# Altium schematic sheet modulation_tx.SchDoc
size A4; SheetNumber: 1; SheetTotal: 1
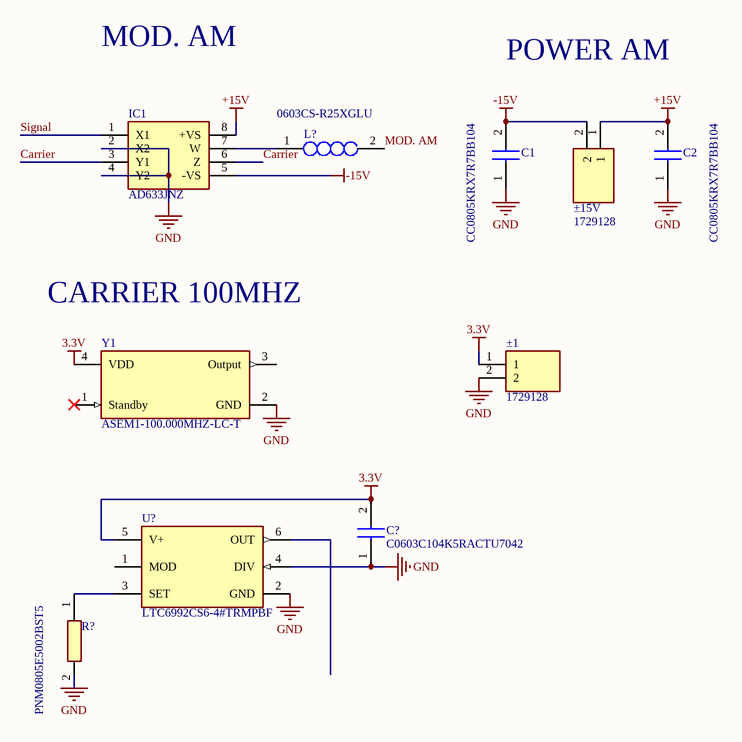
[diagram p0: modulation_tx.SchDoc]

## Parts
C1  CC0805KRX7R7BB104  [CAPC2012X95N]
C2  CC0805KRX7R7BB104  [CAPC2012X95N]
C?  C0603C104K5RACTU7042  [CAPC1608X95N]
IC1  AD633JNZ  [DIP794W56P254L959H533Q8N]
L?  0603CS-R25XGLU  [0603CS82NXGLW]
R?  PNM0805E5002BST5  [RESC2013X65N]
U?  LTC6992CS6-4#TRMPBF  [FP-S6-6-05-08-1636-IPC_A]
Y1  ASEM1-100.000MHZ-LC-T  [FP-ASEM-MFG]
±1  1729128  [1729128]
±15V  1729128  [1729128]

## Nets
3.3V: C?.2 U?.5(V+) Y1.4(VDD) ±1.1
+15V: C2.2 IC1.8(+VS) ±15V.1
-15V: C1.2 IC1.5(-VS) ±15V.2
GND: C1.1 C2.1 C?.1 IC1.2(X2) IC1.4(Y2) R?.2 U?.2(GND) U?.4(DIV) Y1.2(GND) ±1.2
Carrier: IC1.3(Y1) IC1.6(Z)
MOD. AM: L?.2
Signal: IC1.1(X1)
NetIC1_7: IC1.7(W) L?.1
NetR?_1: R?.1 U?.3(SET)

Not connected (* = marked no-connect by the designer): U? 1(MOD) 6(OUT); Y1 1(Standby)* 3(Output)

## Notes on the sheet
- MOD. AM
- POWER AM
- CARRIER 100MHZ

## Library data of the parts
C1 C2 = CC0805KRX7R7BB104: Capacitor; Manufacturer_Name: YAGEO; Datasheet Link: https://www.yageo.com/en/Chart/Download/pdf/CC0805KRX7R7BB104; Height: 0.95mm; Manufacturer_Part_Number: CC0805KRX7R7BB104; Mouser Part Number: 603-CC805KRX7R7BB104; Mouser Price/Stock: https://www.mouser.co.uk/ProductDetail/YAGEO/CC0805KRX7R7BB104?qs=AgBp2OyFlx9i%252BgKMLa7NIA%3D%3D; Arrow Part Number: CC0805KRX7R7BB104; Arrow Price/Stock: https://www.arrow.com/en/products/cc0805krx7r7bb104/yageo?region=nac
C? = C0603C104K5RACTU7042: Capacitor; Manufacturer_Name: KEMET; Datasheet Link: https://www.arrow.com/en/products/c0603c104k5ractu7042/kemet-corporation; Height: 0.95mm; Manufacturer_Part_Number: C0603C104K5RACTU7042; Arrow Part Number: C0603C104K5RACTU7042; Arrow Price/Stock: https://www.arrow.com/en/products/c0603c104k5ractu7042/kemet-corporation
IC1 = AD633JNZ: Integrated Circuit; Manufacturer_Name: Analog Devices; Datasheet Link: http://www.analog.com/media/en/technical-documentation/data-sheets/AD633.pdf; Height: 5.33mm; Manufacturer_Part_Number: AD633JNZ; Mouser Part Number: 584-AD633JNZ; Mouser Price/Stock: https://www.mouser.co.uk/ProductDetail/Analog-Devices/AD633JNZ?qs=NmRFExCfTkGoBbkS43oI5A%3D%3D; Arrow Part Number: AD633JNZ; Arrow Price/Stock: https://www.arrow.com/en/products/ad633jnz/analog-devices?region=europe
L? = 0603CS-R25XGLU: Inductor; Manufacturer_Name: COILCRAFT; Datasheet Link: https://www.coilcraft.com/pdfs/0603cs.pdf; Height: 1mm; Manufacturer_Part_Number: 0603CS-R25XGLU
R? = PNM0805E5002BST5: Resistor; Manufacturer_Name: Vishay; Manufacturer_Part_Number: PNM0805E5002BST5; Mouser Part Number: 71-PNM0805E5002BST5; Mouser Price/Stock: https://www.mouser.co.uk/ProductDetail/Vishay-Thin-Film/PNM0805E5002BST5?qs=oBjDkOCjPF2e0mIJnhvcEA%3D%3D; Arrow Part Number: PNM0805E5002BST5; Arrow Price/Stock: https://www.arrow.com/en/products/pnm0805e5002bst5/vishay?region=nac
U? = CMP-09079-000031-1: IC OSC SILICON PROG TSOT23-6; Max Supply Voltage: 5.5V; Min Supply Voltage: 2.25V; Frequency: 3.81Hz; Number of Timers/Counters: 1; Operating Supply Current: 365uA; Mount: Surface Mount; Max Operating Temperature: 70°C; Number of Pins: 6; Length: 2.9mm; REACH SVHC: No SVHC; RoHS Compliant: Yes; Min Operating Temperature: 0°C; Series: TimerBlox®; Package Quantity: 500; Radiation Hardening: No; Packaging: Tape and Reel; Case/Package: TSOT; Depth: 1.75mm
Y1 = CMP-27762-005945-1: MEMS OSC XO 100.0000MHZ CMOS SMD; Min Supply Voltage: 3V; Frequency: 100MHz; Load Capacitance: 15pF; Max Supply Current: 10mA; Operating Supply Voltage: 3.3V; Max Supply Voltage: 3.6V; Frequency Stability: 50ppm; Min Operating Temperature: -40°C; Radiation Hardening: No; Series: Pure Silicon™ ASEM; Lead Free: Lead Free; Width: 0.098inch; Max Operating Temperature: 85°C; Mount: Surface Mount; Packaging: Tape and Reel; Length: 0.126inch; Number of Pins: 4; Height: 0.035inch; Case/Package: SMD/SMT
±1 ±15V = 1729128: Connector; Manufacturer_Name: Phoenix Contact; Datasheet Link: http://www.phoenixcontact.net/product/1729128; Height: 10.15mm; Manufacturer_Part_Number: 1729128; Mouser Part Number: 651-1729128; Mouser Price/Stock: https://www.mouser.co.uk/ProductDetail/Phoenix-Contact/1729128?qs=GFUSqQMLmmnCBVBY3dts9w%3D%3D; Arrow Part Number: 1729128; Arrow Price/Stock: https://www.arrow.com/en/products/1729128/phoenix-contact?region=nac